# EAGLE design SparkFun_Soil_Moisture_Sensor (EAGLE 7.2.0)
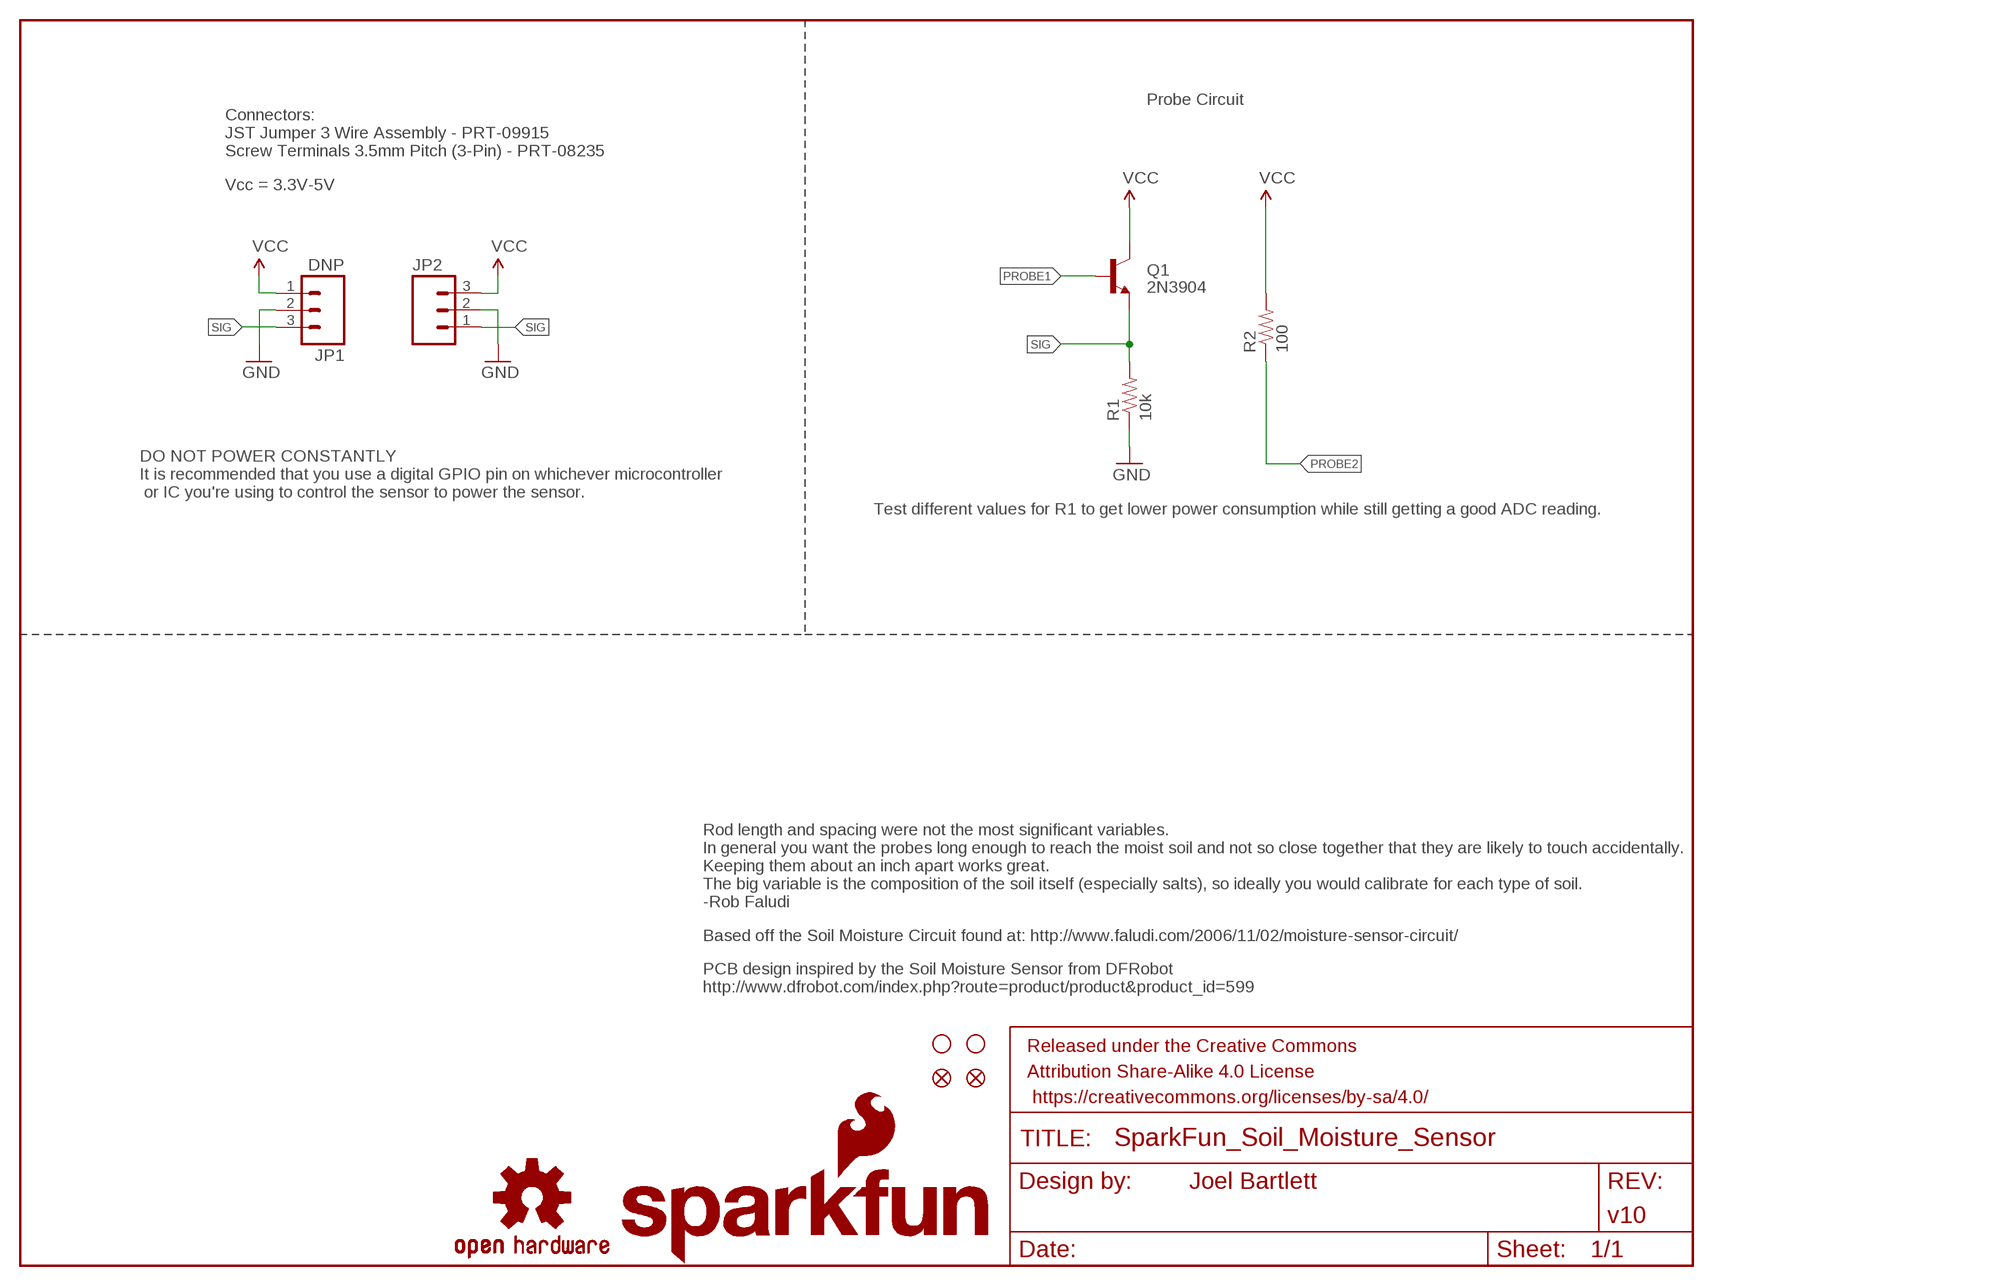
[diagram p0: schematic, sheet 1]

## Parts
FID1  FIDUCIAL1X2  [FIDUCIAL-1X2]
FID2  FIDUCIAL1X2  [FIDUCIAL-1X2]
FRAME1  FRAME-LETTER  [CREATIVE_COMMONS]
JP1  DNP  M03POLAR  [MOLEX-1X3]
JP2  M03SCREW_LOCK  [SCREWTERMINAL-3.5MM-3_LOCK.007S]
LOGO1  SFE_LOGO_NAME_FLAME.1_INCH  [SFE_LOGO_NAME_FLAME_.1]
LOGO2  OSHW-LOGOS  [OSHW-LOGO-S]
Q1  2N3904  TRANSISTOR_NPNMMBT2222A  [SOT23-3]
R1  10k  100OHM-1/4W-5%(0603)  [0603-RES]
R2  100  100OHM-1/4W-5%(0603)  [0603-RES]
STANDOFF1  STAND-OFF  [STAND-OFF]
STANDOFF2  STAND-OFF  [STAND-OFF]

## Nets
GND: JP1.2 JP2.2 R1.1
PROBE1: Q1.1(B)
PROBE2: R2.1
SIG: JP1.3 JP2.1 Q1.2(E) R1.2
VCC: JP1.1 JP2.3 Q1.3(C) R2.2

## Notes on the sheet
- Probe Circuit
- Connectors: 
  JST Jumper 3 Wire Assembly - PRT-09915
  Screw Terminals 3.5mm Pitch (3-Pin) - PRT-08235
- Vcc = 3.3V-5V
- DO NOT POWER CONSTANTLY 
  It is recommended that you use a digital GPIO pin on whichever microcontroller
   or IC you're using to control the sensor to power the sensor.
- Test different values for R1 to get lower power consumption while still getting a good ADC reading.
- Rod length and spacing were not the most significant variables. 
  In general you want the probes long enough to reach the moist soil and not so close together that they are likely to touch accidentally. 
  Keeping them about an inch apart works great. 
  The big variable is the composition of the soil itself (especially salts), so ideally you would calibrate for each type of soil. 
  -Rob Faludi
- Based off the Soil Moisture Circuit found at: http://www.faludi.com/2006/11/02/moisture-sensor-circuit/
- PCB design inspired by the Soil Moisture Sensor from DFRobot
  http://www.dfrobot.com/index.php?route=product/product&product_id=599

## Library data of the parts
FID1 FID2 = SparkFun-Aesthetics:FIDUCIAL: Fiducial Alignment Points Various fiducial points for machine vision alignment.
FRAME1 = SparkFun-Aesthetics:FRAME-LETTER: Schematic Frame Standard 8.5x11 US Letter frame; DESIGNER: Joel Bartlett; VERSION: v10
JP1 = SparkFun-Connectors:M03: Header 3 Standard 3-pin 0.1" header. Use with straight break away headers (SKU : PRT-00116), right angle break away headers (PRT-00553), swiss pins (PRT-00743), machine pins (PRT-00117), and female headers (PRT-00115). Molex polarized connector foot print use with SKU : PRT-08232 with associated crimp pins and housings.
JP2 = SparkFun-Connectors:M03: Header 3 Standard 3-pin 0.1" header. Use with straight break away headers (SKU : PRT-00116), right angle break away headers (PRT-00553), swiss pins (PRT-00743), machine pins (PRT-00117), and female headers (PRT-00115). Molex polarized connector foot print use with SKU : PRT-08232 with associated crimp pins and housings.; PROD_ID: CONN-08288
LOGO1 = SparkFun-Aesthetics:SFE_LOGO_NAME_FLAME: SFE Logo, name and flame This is the SparkFun full logo. The logo on the schematic will always be the same size; the package variant is the height of the flame part of the logo. Default layer for the logo on the board is tSilk.
LOGO2 = SparkFun-Aesthetics:OSHW-LOGO: Open Source Hardware Logo This logo indicates the piece of hardware it is found on incorporates a OSHW license and/or adheres to the definition of open source hardware found here: http://freedomdefined.org/OSHW
Q1 = SparkFun-DiscreteSemi:TRANSISTOR_NPN: Generic NPN BJT MMBT2222A - TRANS-08049 (SOT-23, 1A 40V) MPSA42 - TRANS-09116 (SOT-23, 500mA 300V) MMBT5088LT1G - TRANS-11160 (SOT-23, 50 mA 30V) BC547 - COM-08928 <http://www.sparkfun.com/products/8928> (TO-92 45V 100mA) (1.Collector 2.Base 3.Emitter) 2N3904 - COM-00521 <http://www.sparkfun.com/products/521> (TO-92 40V 200mA) (1.Emitter 2.Base 3.Collector) P2N2222A - COM-12852 <http://www.sparkfun.com/products/12852> (TO-92 40V 600mA) (1.Collector 2.Base 3.Emitter); PROD_ID: TRANS-08049; VALUE: MMBT2222A
R1 R2 = SparkFun-Resistors:100OHM-1/4W-5%(0603); PROD_ID: RES-12438; VALUE: 100/.25W
STANDOFF1 STANDOFF2 = SparkFun-Electromechanical:STAND-OFF: #4 Stand Off This is the mechanical footprint for a #4 phillips button head screw. Use the keepout ring to avoid running the screw head into surrounding components. SKU : PRT-00447

## Board
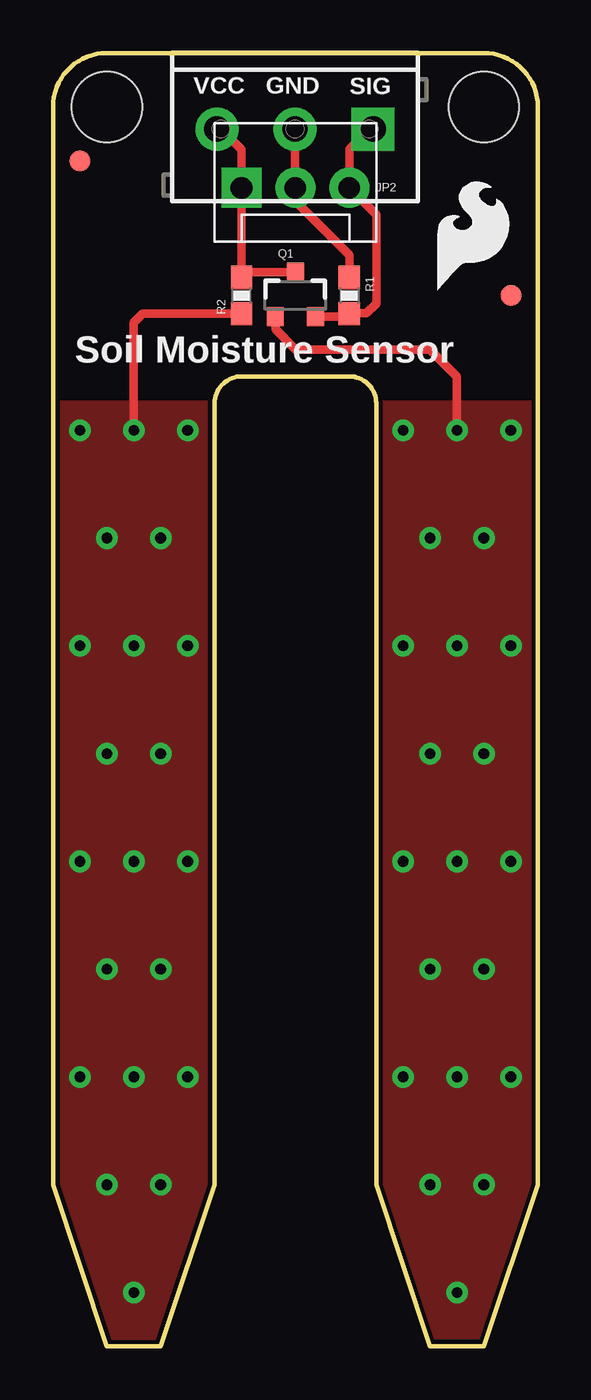
[diagram p1: board, top side]
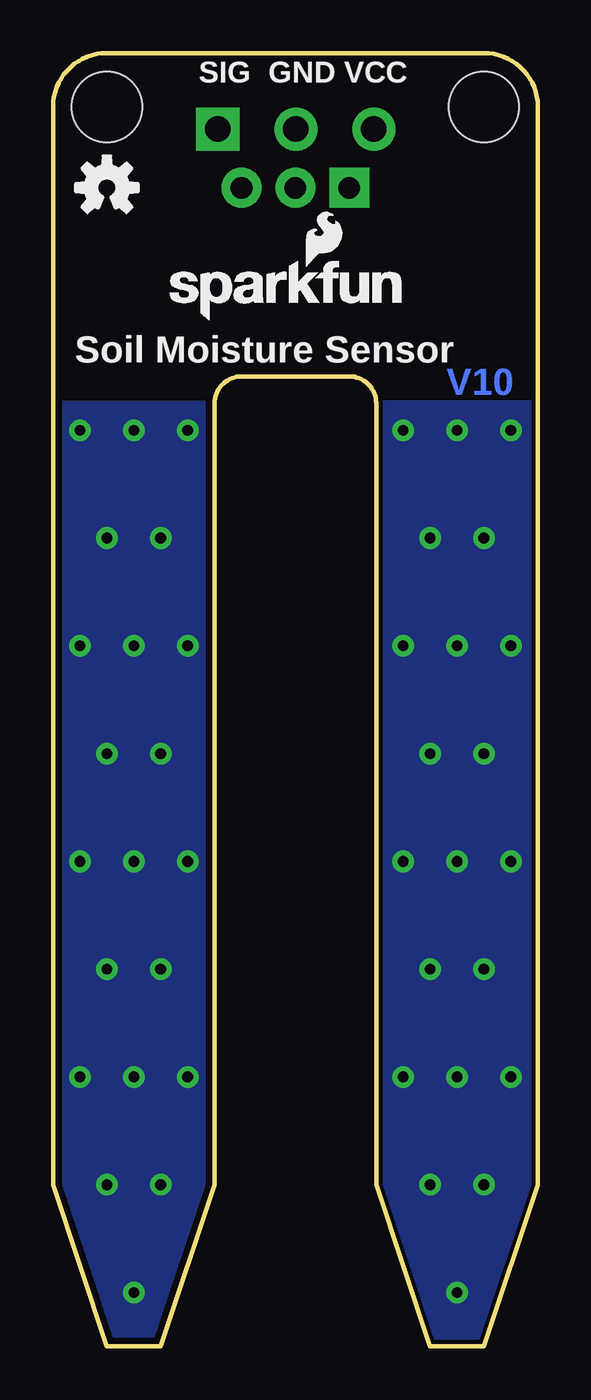
[diagram p2: board, bottom side, seen from below]

Size 22.86 x 60.96 mm. Coordinates in mm from the lower left corner, seen from the top.
Outline: 2.54,60.96 arc90 0,58.42 0,7.62 2.54,0 5.08,0 7.62,7.62 7.62,44.45 arc-90 8.89,45.72 13.97,45.72 arc-90 15.24,44.45 15.24,7.62 17.78,0 20.32,0 22.86,7.62 22.86,58.42 arc90 20.32,60.96 2.54,60.96
Copper layers (1*16): Top 0.035mm / dielectric 1.5mm / Bottom 0.035mm
Design rules "SparkFun-2-layer": minimum track width 7mil, minimum drill 15mil, track to track 8mil, track to pad 8mil, pad to pad 8mil, via to via 8mil, smd to smd 8mil, copper to edge 8mil, drill to drill 8mil, minimum pad ring 12mil, minimum via ring 10mil, stop-mask expansion 4mil, vias tented up to drill 20mil, thermal gap 10mil

### Footprints (pad centres in the part's own frame; a part is rotated, then mirrored left to right if it is on the bottom)
FIDUCIAL-1X2 = smd 1 x 1: 1 0,0
MOLEX-1X3 = drill 1.016 pad 1.88 square: 1 0,0 | drill 1.016 pad 1.88: 2 2.54,0; 3 5.08,0
SCREWTERMINAL-3.5MM-3_LOCK.007S = drill 1.2 pad 2.032 square: 1 -0.178,0 | drill 1.2 pad 2.032: 2 3.5,0; 3 7.178,0
SOT23-3 = smd 0.8 x 0.9: 1 -0.95,-1; 2 0.95,-1; 3 0,1.1
0603-RES = smd 1.1 x 1: 1 -0.85,0; 2 0.85,0
STAND-OFF = hole 3.302: 0,0

### Placement (x,y rotation side)
FID1  1.27,55.88 0 top
FID2  21.59,49.53 0 top
FRAME1  -7.62,-10.16 0 top  (outside the outline)
JP1  8.89,54.61 0 top
JP2  14.91,57.38 180 top
LOGO1  17.78,48.26 0 bottom
LOGO2  20.32,54.61 0 bottom
Q1  11.43,49.53 0 top
R1  13.97,49.53 270 top
R2  8.89,49.53 90 top
STANDOFF1  2.54,58.42 0 top
STANDOFF2  20.32,58.42 0 top
U$4  [SFE_LOGO_FLAME_.2]  17.78,49.53 0 top

### Tracks (layer width: path | path; a pad name or v marks a point on that pad's centre or on a via)
GND
  Top 0.254: 11.41,54.63 JP1.2
  Top 0.406: JP1.2 11.43,53.98 13.97,51.44 R1.1 | 11.41,54.63 JP2.2
PROBE1  (via drill 0.51)
  Top 0.406: Q1.1 10.48,47.94 11.43,46.99 17.78,46.99 19.05,45.72 v19.05,43.18
  other vias: 16.51,43.18 21.59,43.18 21.59,33.02 19.05,33.02 16.51,33.02 16.51,22.86 19.05,22.86 21.59,22.86 21.59,12.7 19.05,12.7 16.51,12.7 17.78,7.62 20.32,7.62 19.05,2.54 17.78,38.1 20.32,38.1 20.32,27.94 17.78,27.94 17.78,17.78 20.32,17.78
  pour Top: 15.24,44.45 15.24,0 22.86,0 22.86,44.45
  pour Bottom (isolate 0.305): 15.24,44.45 15.24,0 22.86,0 22.86,44.45
PROBE2  (via drill 0.51)
  Top 0.406: v3.81,43.18 3.81,48.26 4.23,48.68 R2.1
  other vias: 6.35,43.18 1.27,43.18 1.27,33.02 3.81,33.02 6.35,33.02 6.35,22.86 3.81,22.86 1.27,22.86 1.27,12.7 3.81,12.7 6.35,12.7 5.08,7.62 2.54,7.62 3.81,2.54 2.54,17.78 5.08,17.78 2.54,27.94 5.08,27.94 2.54,38.1 5.08,38.1
  pour Top: 0,44.45 0,0 7.62,0 7.62,44.45
  pour Bottom: 0,44.45 0,0 7.62,0 7.62,44.45
SIG
  Top 0.254: 13.82,48.53 R1.2 13.98,48.69
  Top 0.406: Q1.2 13.82,48.53 | 13.98,48.69 14.78,48.69 15.24,49.15 15.24,53.34 JP1.3 13.97,56.44 14.91,57.38 JP2.1
VCC
  Top 0.254: R2.2 9.14,50.63
  Top 0.406: 9.14,50.63 Q1.3 | R2.2 JP1.1 8.89,56.4 7.91,57.38 JP2.3

### Text on the board
Bottom: V10
tPlace: VCC | GND | SIG | Soil Moisture Sensor
bPlace: VCC | GND | SIG | Soil Moisture Sensor
tDocu: Joel Bartlett